# EAGLE design mega_pro-v13 (EAGLE 5.11)
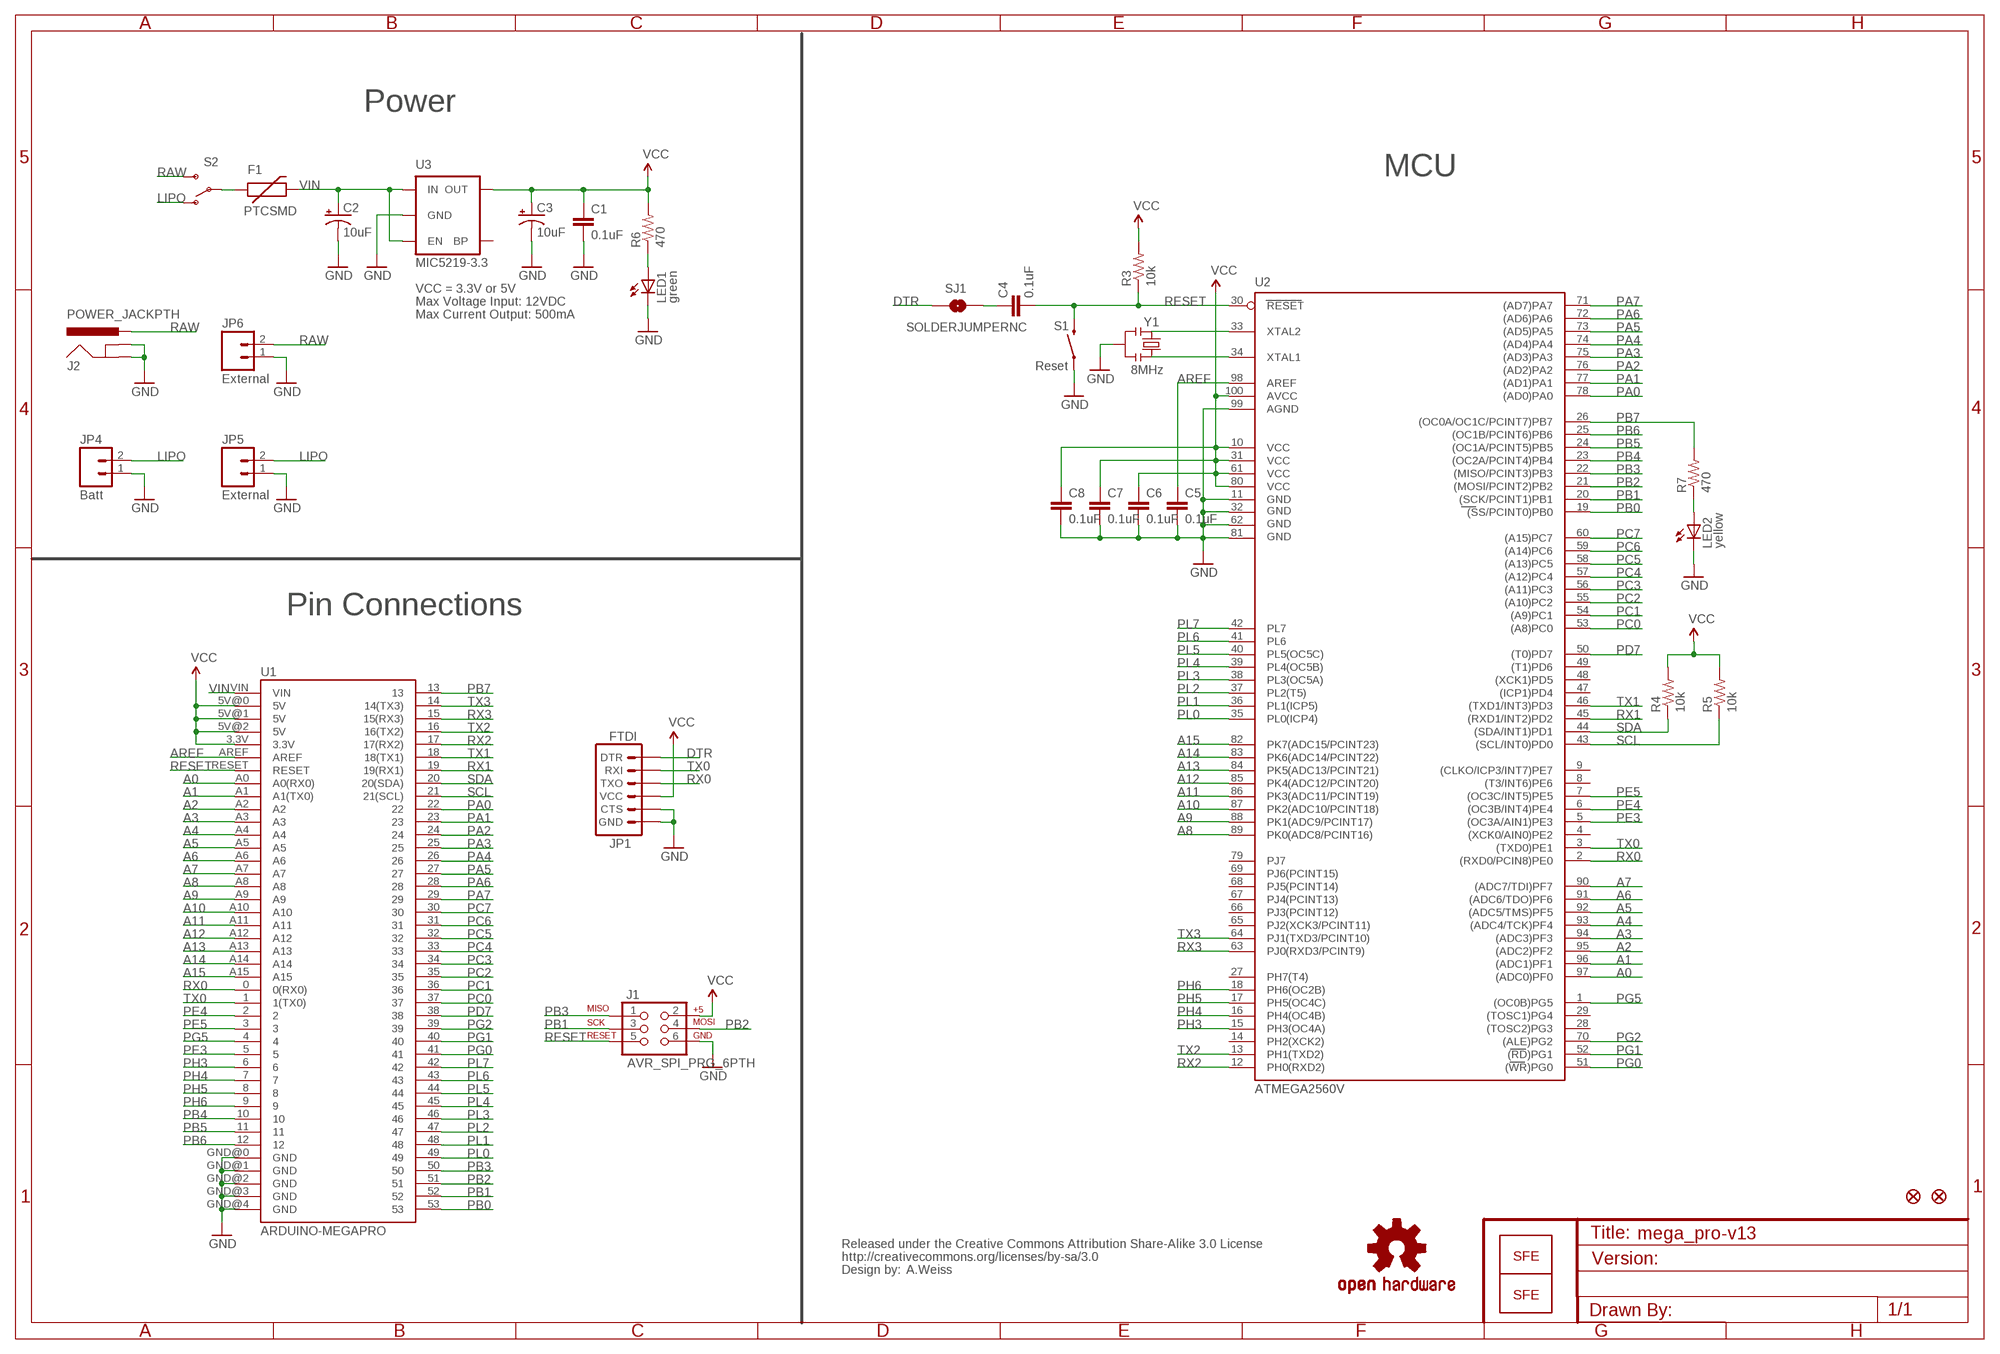
[diagram p0: schematic, sheet 1]

## Parts
C1  0.1uF  CAP0402-CAP  [0402-CAP]
C2  10uF  CAP_POL1206  [EIA3216]
C3  10uF  CAP_POL1206  [EIA3216]
C4  0.1uF  CAP0402-CAP  [0402-CAP]
C5  0.1uF  CAP0402-CAP  [0402-CAP]
C6  0.1uF  CAP0402-CAP  [0402-CAP]
C7  0.1uF  CAP0402-CAP  [0402-CAP]
C8  0.1uF  CAP0402-CAP  [0402-CAP]
F1  PTCSMD  [PTC-1206]
J1  AVR_SPI_PRG_6PTH  [2X3]
J2  POWER_JACKPTH  [POWER_JACK_PTH]
JP1  FTDI  ARDUINO_SERIAL_PROGRAMSMD  [1X06-SMD]
JP2  LOGO-SFENEW  [SFE-NEW-WEBLOGO]
JP3  LOGO-SFENEW  [SFE-NEW-WEBLOGO]
JP4  Batt  M02-JST-2MM-SMT  [JST-2-SMD]
JP5  External  M02PTH  [1X02]
JP6  External  M02PTH  [1X02]
JP7  FIDUCIAL1X2.5  [FIDUCIAL-1X2.5]
JP8  FIDUCIAL1X2.5  [FIDUCIAL-1X2.5]
LED1  green  LED0603  [LED-0603]
LED2  yellow  LED0603  [LED-0603]
R3  10k  RESISTOR0402-RES  [0402-RES]
R4  10k  RESISTOR0402-RES  [0402-RES]
R5  10k  RESISTOR0402-RES  [0402-RES]
R6  470  RESISTOR0402-RES  [0402-RES]
R7  470  RESISTOR0402-RES  [0402-RES]
S1  SWITCH-MOMENTARY-2SMD  [TACTILE_SWITCH_SMD]
S2  SWITCH-SPST-SMD-A  [SWITCH-SPST-SMD-A]
SJ1  SOLDERJUMPERNC  [SJ_2S]
U1  ARDUINO-MEGAPRO  [ARDUINO_MEGA-PRO]
U2  ATMEGA2560AU  [TQFP100]
U3  V_REG_LDOSMD  [SOT23-5]
U$1  OSHW-LOGOM  [OSHW-LOGO-M]
U$2  CREATIVE_COMMONS  [CREATIVE_COMMONS]
Y1  RESONATORSMD  [RESONATOR-SMD]

## Nets
A0: U1.A0(A0(RX0)) U2.97((ADC0)PF0)
A1: U1.A1(A1(TX0)) U2.96((ADC1)PF1)
A2: U1.A2 U2.95((ADC2)PF2)
A3: U1.A3 U2.94((ADC3)PF3)
A4: U1.A4 U2.93((ADC4/TCK)PF4)
A5: U1.A5 U2.92((ADC5/TMS)PF5)
A6: U1.A6 U2.91((ADC6/TDO)PF6)
A7: U1.A7 U2.90((ADC7/TDI)PF7)
A8: U1.A8 U2.89(PK0(ADC8/PCINT16))
A9: U1.A9 U2.88(PK1(ADC9/PCINT17))
A10: U1.A10 U2.87(PK2(ADC10/PCINT18))
A11: U1.A11 U2.86(PK3(ADC11/PCINT19))
A12: U1.A12 U2.85(PK4(ADC12/PCINT20))
A13: U1.A13 U2.84(PK5(ADC13/PCINT21))
A14: U1.A14 U2.83(PK6(ADC14/PCINT22))
A15: U1.A15 U2.82(PK7(ADC15/PCINT23))
AREF: C5.1 U1.AREF U2.98(AREF)
DTR: JP1.1(DTR) SJ1.1
GND: C1.2 C2.C(-) C3.C(-) C5.2 C6.2 C7.2 C8.2 J1.6 J2.GND J2.GNDBREAK JP1.5(CTS) JP1.6(GND) JP4.1 JP5.1 JP6.1 LED1.C LED2.C S1.1 U1.GND@0(GND) U1.GND@1(GND) U1.GND@2(GND) U1.GND@3(GND) U1.GND@4(GND) U2.11(GND) U2.32(GND1) U2.62(GND2) U2.81(GND3) U2.99(AGND) U3.2(GND) Y1.2
LIPO: JP4.2 JP5.2 S2.1(O)
N$1: F1.1 S2.2(P)
N$2: LED1.A R6.1
N$3: LED2.A R7.1
N$4: C4.1 SJ1.2
N$73: U2.33(XTAL2) Y1.1
N$74: U2.34(XTAL1) Y1.3
PA0: U1.22 U2.78((AD0)PA0)
PA1: U1.23 U2.77((AD1)PA1)
PA2: U1.24 U2.76((AD2)PA2)
PA3: U1.25 U2.75((AD3)PA3)
PA4: U1.26 U2.74((AD4)PA4)
PA5: U1.27 U2.73((AD5)PA5)
PA6: U1.28 U2.72((AD6)PA6)
PA7: U1.29 U2.71((AD7)PA7)
PB0: U1.53 U2.19((SS/PCINT0)PB0)
PB1: J1.3 U1.52 U2.20((SCK/PCINT1)PB1)
PB2: J1.4 U1.51 U2.21((MOSI/PCINT2)PB2)
PB3: J1.1 U1.50 U2.22((MISO/PCINT3)PB3)
PB4: U1.10 U2.23((OC2A/PCINT4)PB4)
PB5: U1.11 U2.24((OC1A/PCINT5)PB5)
PB6: U1.12 U2.25((OC1B/PCINT6)PB6)
PB7: R7.2 U1.13 U2.26((OC0A/OC1C/PCINT7)PB7)
PC0: U1.37 U2.53((A8)PC0)
PC1: U1.36 U2.54((A9)PC1)
PC2: U1.35 U2.55((A10)PC2)
PC3: U1.34 U2.56((A11)PC3)
PC4: U1.33 U2.57((A12)PC4)
PC5: U1.32 U2.58((A13)PC5)
PC6: U1.31 U2.59((A14)PC6)
PC7: U1.30 U2.60((A15)PC7)
PD7: U1.38 U2.50((T0)PD7)
PE3: U1.5 U2.5((OC3A/AIN1)PE3)
PE4: U1.2 U2.6((OC3B/INT4)PE4)
PE5: U1.3 U2.7((OC3C/INT5)PE5)
PG0: U1.41 U2.51((WR)PG0)
PG1: U1.40 U2.52((RD)PG1)
PG2: U1.39 U2.70((ALE)PG2)
PG5: U1.4 U2.1((OC0B)PG5)
PH3: U1.6 U2.15(PH3(OC4A))
PH4: U1.7 U2.16(PH4(OC4B))
PH5: U1.8 U2.17(PH5(OC4C))
PH6: U1.9 U2.18(PH6(OC2B))
PL0: U1.49 U2.35(PL0(ICP4))
PL1: U1.48 U2.36(PL1(ICP5))
PL2: U1.47 U2.37(PL2(T5))
PL3: U1.46 U2.38(PL3(OC5A))
PL4: U1.45 U2.39(PL4(OC5B))
PL5: U1.44 U2.40(PL5(OC5C))
PL6: U1.43 U2.41(PL6)
PL7: U1.42 U2.42(PL7)
RAW: J2.PWR JP6.2 S2.3(S)
RESET: C4.2 J1.5 R3.1 S1.3 U1.RESET U2.30(RESET)
RX0: JP1.3(TXO) U1.0(0(RX0)) U2.2((RXD0/PCIN8)PE0)
RX1: U1.19(19(RX1)) U2.45((RXD1/INT2)PD2)
RX2: U1.17(17(RX2)) U2.12(PH0(RXD2))
RX3: U1.15(15(RX3)) U2.63(PJ0(RXD3/PCINT9))
SCL: R5.1 U1.21(21(SCL)) U2.43((SCL/INT0)PD0)
SDA: R4.1 U1.20(20(SDA)) U2.44((SDA/INT1)PD1)
TX0: JP1.2(RXI) U1.1(1(TX0)) U2.3((TXD0)PE1)
TX1: U1.18(18(TX1)) U2.46((TXD1/INT3)PD3)
TX2: U1.16(16(TX2)) U2.13(PH1(TXD2))
TX3: U1.14(14(TX3)) U2.64(PJ1(TXD3/PCINT10))
VCC: C1.1 C3.A(+) C6.1 C7.1 C8.1 J1.2 JP1.4(VCC) R3.2 R4.2 R5.2 R6.2 U1.3.3V U1.5V@0(5V) U1.5V@1(5V) U1.5V@2(5V) U2.10(VCC) U2.31(VCC1) U2.61(VCC2) U2.80(VCC3) U2.100(AVCC) U3.5(OUT)
VIN: C2.A(+) F1.2 U1.VIN U3.1(IN) U3.3(EN)
Unconnected: U2.4((XCK0/AIN0)PE2) U2.8((T3/INT6)PE6) U2.9((CLKO/ICP3/INT7)PE7) U2.14(PH2(XCK2)) U2.27(PH7(T4)) U2.28((TOSC2)PG3) U2.29((TOSC1)PG4) U2.47((ICP1)PD4) U2.48((XCK1)PD5) U2.49((T1)PD6) U2.65(PJ2(XCK3/PCINT11)) U2.66(PJ3(PCINT12)) U2.67(PJ4(PCINT13)) U2.68(PJ5(PCINT14)) U2.69(PJ6(PCINT15)) U2.79(PJ7) U3.4(BP)

## Notes on the sheet
- Power
- MCU
- MIC5219-3.3
- VCC = 3.3V or 5V
- Max Voltage Input: 12VDC
- Max Current Output: 500mA
- Reset
- 8MHz
- Pin Connections
- ATMEGA2560V
- A.Weiss

## Library data of the parts
C1 C4-C8 = SparkFun:CAP: Capacitor Standard 0603 ceramic capacitor, and 0.1" leaded capacitor.
C2 C3 = SparkFun:CAP_POL: Capacitor Polarized These are standard SMD and PTH capacitors. Normally 10uF, 47uF, and 100uF in electrolytic and tantalum varieties. Always verify the external diameter of the through hole cap, it varies with capacity, voltage, and manufacturer. The EIA devices should be standard.
F1 = SparkFun:PTC: Resettable Fuse PTC Resettable Fuse. Spark Fun Electronics SKU : COM-08357
J1 = SparkFun:AVR_SPI_PRG_6: AVR ISP 6 Pin This is the reduced ISP connector for AVR programming. Common on Arduino. This footprint will take up less PCB space and can be used with a 10-pin to 6-pin adapter such as SKU: BOB-08508
J2 = SparkFun:POWER_JACK: Power Jack This is the standard 5.5mm barrel jack for power. The PTH is the most common, proven, reliable, footprint. All others are experimental. The Slot footprint only works if the mill layer is transmitted to the PCB fab house so be warned. Spark Fun Electronics SKU : PRT-00119. Mating wall wart : TOL-00298 (and others)
JP1 = SparkFun:ARDUINO_SERIAL_PROGRAM
JP2 JP3 = SparkFun:LOGO-SFE: Spark Fun Electronics PCB Logo This is the standard Spark Fun Electronics PCB logo.
JP4-JP6 = SparkFun:M02: Header 2 Standard 2-pin 0.1" header. Use with straight break away headers (SKU : PRT-00116), right angle break away headers (PRT-00553), swiss pins (PRT-00743), machine pins (PRT-00117), and female headers (PRT-00115). Molex polarized connector foot print use with SKU : PRT-08233 with associated crimp pins and housings.
JP7 JP8 = abes:FIDUCIAL: Fiducial Alignment Points Various fiducial points for machine vision alignment.
LED1 LED2 = SparkFun:LED: LEDs Standard schematic elements and footprints for 5mm, 3mm, 1206, and 0603 sized LEDs. 5mm - Spark Fun Electronics SKU : COM-00529 (and others)
R3-R7 = SparkFun:RESISTOR: Resistor Basic schematic elements and footprints for 0603, 1206, and PTH resistors.
S1 = SparkFun:SWITCH-MOMENTARY-2
S2 = SparkFun:SWITCH-SPST: SPST Switch Simple slide switch. Spark Fun Electronics SKU : COM-00102
SJ1 = SparkFun:SOLDERJUMPER: Solder Jumper Standard SMD solder jumper. Used to automate production. Two varients : Normally Open and Normally Closed are the same, but have different paste layers. NC will have a large amount of paste and should jumper during reflow.
U1 = SparkFun:ARDUINO-MEGA: Arduino Mega footprint connections
U2 = SparkFun:ATMEGA2560: MICROCONTROLLER 64/128/256 Kbytes FLASH 4 Kbytes EEPROM 8 Kbytes SRAM 86 General Purpose I/O pins 12-channels16-bit PWM 4 x Serial USARTs 16-channels 10-bit A/D
U3 = SparkFun:V_REG_LDO: Voltage Regulator LDO Standard 150mA LDO voltage regulator in SOT-23 layout. Micrel part MIC5205. BP (by-pass) pin is used to lower output noise with 470pF cap.
U$1 = SparkFun:OSHW-LOGO: Open Source Hardware Logo This logo indicates the piece of hardware it is found on incorporates a OSHW license and/or adheres to the definition of open source hardware found here: http://freedomdefined.org/OSHW
U$2 = SparkFun:CREATIVE_COMMONS
Y1 = SparkFun:RESONATOR: Resonator Small SMD resonator. This is the itty bitty 10/20MHz resonators with built in caps. CSTCE10M0G55 and CSTCE20M0V53. Footprint has been reviewed closely but hasn't been tested yet.

## Board
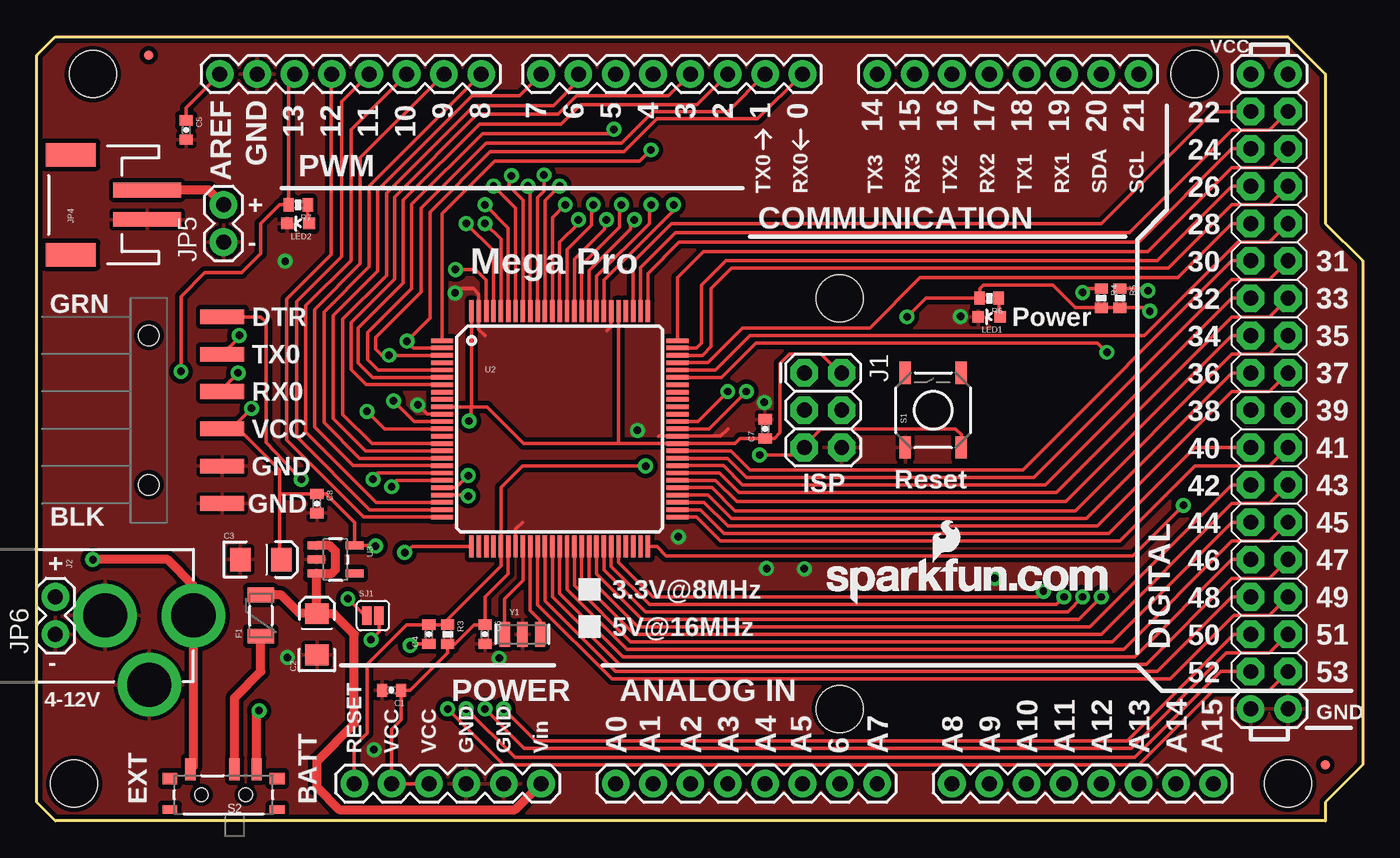
[diagram p1: board, top side]
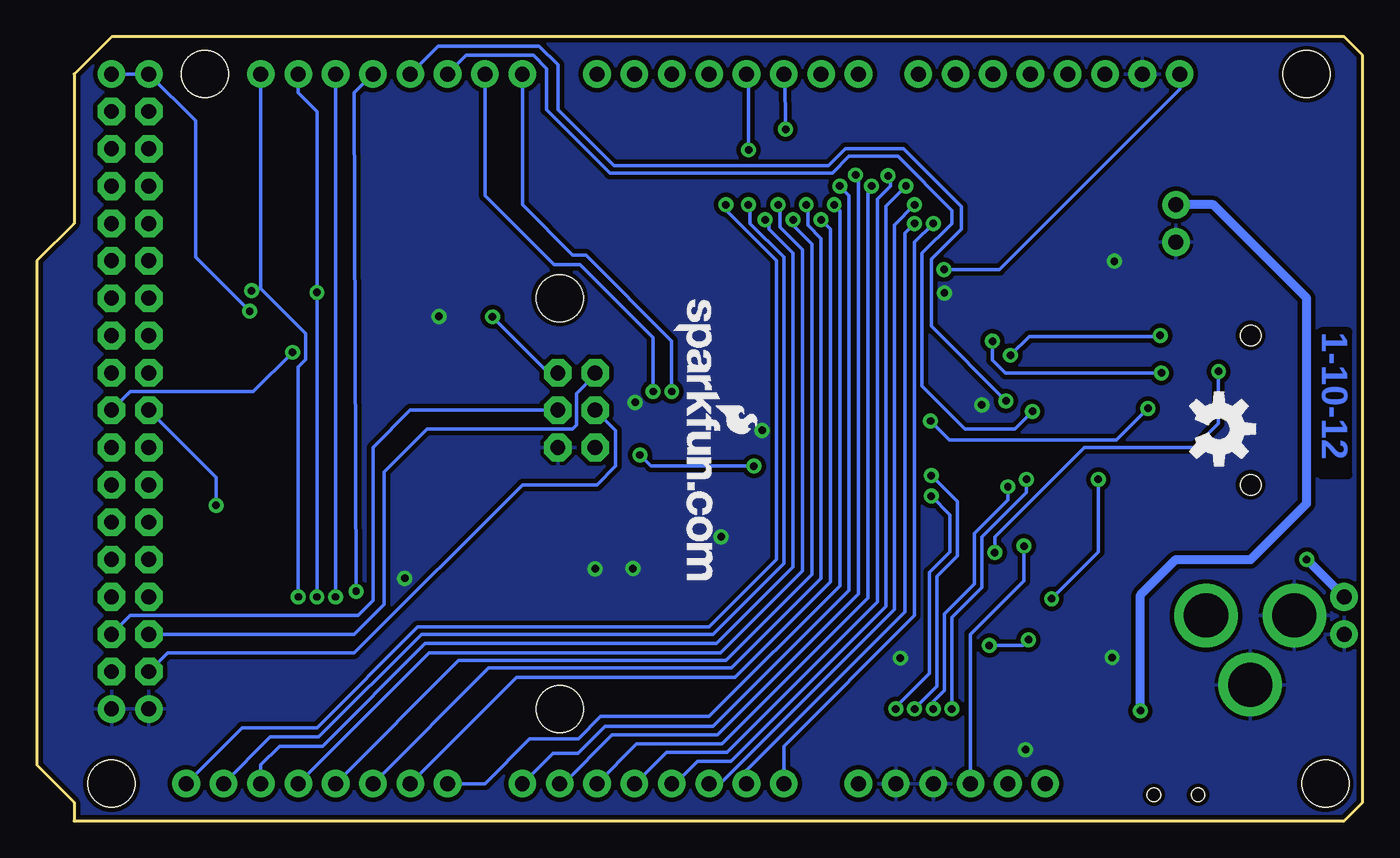
[diagram p2: board, bottom side, seen from below]

Size 90.17 x 53.34 mm. Coordinates in mm from the lower left corner, seen from the top.
Copper layers (1*16): Top 0.035mm / dielectric 1.5mm / Bottom 0.035mm
Design rules "SparkFun": minimum track width 8mil, minimum drill 20mil, track to track 8mil, track to pad 8mil, pad to pad 8mil, via to via 8mil, smd to smd 8mil, copper to edge 8mil, drill to drill 8mil, minimum pad ring 12mil, minimum via ring 10mil, stop-mask expansion 4mil, vias tented up to drill 20mil, thermal gap 10mil

### Footprints (pad centres in the part's own frame; a part is rotated, then mirrored left to right if it is on the bottom)
0402-CAP = smd 0.7 x 0.9: 1 -0.65,0; 2 0.65,0
EIA3216 = smd 1.4 x 1.6: A 1.4,0; C -1.4,0
PTC-1206 = smd 1 x 1.8: 1 -1.4,0; 2 1.4,0
2X3 = drill 1.016 pad 1.88 octagon: 1 0,0; 2 0,2.54; 3 2.54,0; 4 2.54,2.54; 5 5.08,0; 6 5.08,2.54
POWER_JACK_PTH = drill 2.997 pad 4.318 round: GND 0,7.7; GNDBREAK 4.7,10.7; PWR 0,13.7
1X06-SMD = smd 1 x 3: 1 -6.35,5; 2 -3.81,5; 3 -1.27,5; 4 1.27,5; 5 3.81,5; 6 6.35,5 | hole 1.4: -5.08,0; 5.08,0
JST-2-SMD = smd 1 x 4.6: 1 -1,-3.7; 2 1,-3.7 | smd 1.6 x 3.4: NC1 -3.4,1.5; NC2 3.4,1.5
1X02 = drill 1.016 pad 1.88 round: 1 0,0; 2 2.54,0
FIDUCIAL-1X2.5 = smd 0.635 x 0.635: 1 0,0
LED-0603 = smd 0.8 x 0.8: A 0,-0.75; C 0,0.75
0402-RES = smd 0.7 x 0.9: 1 -0.65,0; 2 0.65,0
TACTILE_SWITCH_SMD = smd 1.524 x 0.762: 1 -2.54,1.905; 2 2.54,1.905; 3 -2.54,-1.905; 4 2.54,-1.905
SWITCH-SPST-SMD-A = smd 0.7 x 1.5: 1 -2.25,-1.75; 2 -0.75,-1.75; 3 2.25,-1.75 | smd 1 x 0.6: GND1 -3.65,1; GND3 3.65,1 | smd 1 x 0.8: GND2 -3.65,-1.1; GND4 3.65,-1.1 | hole 0.9: -1.5,0; 1.5,0
SJ_2S = smd 0.635 x 1.27: 1 -0.412,0; 2 0.412,0
ARDUINO_MEGA-PRO = drill 1.016 pad 1.88 round: 0 52.07,50.8; 1 49.53,50.8; 2 46.99,50.8; 3 44.45,50.8; 3.3V 24.13,2.54; 4 41.91,50.8; 5 39.37,50.8; 5V@0 26.67,2.54; 5V@1 82.55,50.8; 5V@2 85.09,50.8; 6 36.83,50.8; 7 34.29,50.8; 8 30.226,50.8; 9 27.686,50.8; 10 25.146,50.8; 11 22.606,50.8; 12 20.066,50.8; 13 17.526,50.8; 14 57.15,50.8; 15 59.69,50.8; 16 62.23,50.8; 17 64.77,50.8; 18 67.31,50.8; 19 69.85,50.8; 20 72.39,50.8; 21 74.93,50.8; A0 39.37,2.54; A1 41.91,2.54; A2 44.45,2.54; A3 46.99,2.54; A4 49.53,2.54; A5 52.07,2.54; A6 54.61,2.54; A7 57.15,2.54; A8 62.23,2.54; A9 64.77,2.54; A10 67.31,2.54; A11 69.85,2.54; A12 72.39,2.54; A13 74.93,2.54; A14 77.47,2.54; A15 80.01,2.54; AREF 12.446,50.8; GND@0 29.21,2.54; GND@1 31.75,2.54; GND@2 82.55,7.62; GND@3 85.09,7.62; GND@4 14.986,50.8; RESET 21.59,2.54; VIN 34.29,2.54 | drill 1.016 pad 1.88 octagon: 22 82.55,48.26; 23 85.09,48.26; 24 82.55,45.72; 25 85.09,45.72; 26 82.55,43.18; 27 85.09,43.18; 28 82.55,40.64; 29 85.09,40.64; 30 82.55,38.1; 31 85.09,38.1; 32 82.55,35.56; 33 85.09,35.56; 34 82.55,33.02; 35 85.09,33.02; 36 82.55,30.48; 37 85.09,30.48; 38 82.55,27.94; 39 85.09,27.94; 40 82.55,25.4; 41 85.09,25.4; 42 82.55,22.86; 43 85.09,22.86; 44 82.55,20.32; 45 85.09,20.32; 46 82.55,17.78; 47 85.09,17.78; 48 82.55,15.24; 49 85.09,15.24; 50 82.55,12.7; 51 85.09,12.7; 52 82.55,10.16; 53 85.09,10.16 | hole 3.2: 3.81,50.8; 2.54,2.54; 54.61,35.56; 54.61,7.62; 78.74,50.8; 85.09,2.54
TQFP100 = smd 1.5 x 0.3: 1 -8,6; 2 -8,5.5; 3 -8,5; 4 -8,4.5; 5 -8,4; 6 -8,3.5; 7 -8,3; 8 -8,2.5; 9 -8,2; 10 -8,1.5; 11 -8,1; 12 -8,0.5; 13 -8,0; 14 -8,-0.5; 15 -8,-1; 16 -8,-1.5; 17 -8,-2; 18 -8,-2.5; 19 -8,-3; 20 -8,-3.5; 21 -8,-4; 22 -8,-4.5; 23 -8,-5; 24 -8,-5.5; 25 -8,-6; 51 8,-6; 52 8,-5.5; 53 8,-5; 54 8,-4.5; 55 8,-4; 56 8,-3.5; 57 8,-3; 58 8,-2.5; 59 8,-2; 60 8,-1.5; 61 8,-1; 62 8,-0.5; 63 8,0; 64 8,0.5; 65 8,1; 66 8,1.5; 67 8,2; 68 8,2.5; 69 8,3; 70 8,3.5; 71 8,4; 72 8,4.5; 73 8,5; 74 8,5.5; 75 8,6 | smd 0.3 x 1.5: 26 -6,-8; 27 -5.5,-8; 28 -5,-8; 29 -4.5,-8; 30 -4,-8; 31 -3.5,-8; 32 -3,-8; 33 -2.5,-8; 34 -2,-8; 35 -1.5,-8; 36 -1,-8; 37 -0.5,-8; 38 0,-8; 39 0.5,-8; 40 1,-8; 41 1.5,-8; 42 2,-8; 43 2.5,-8; 44 3,-8; 45 3.5,-8; 46 4,-8; 47 4.5,-8; 48 5,-8; 49 5.5,-8; 50 6,-8; 76 6,8; 77 5.5,8; 78 5,8; 79 4.5,8; 80 4,8; 81 3.5,8; 82 3,8; 83 2.5,8; 84 2,8; 85 1.5,8; 86 1,8; 87 0.5,8; 88 0,8; 89 -0.5,8; 90 -1,8; 91 -1.5,8; 92 -2,8; 93 -2.5,8; 94 -3,8; 95 -3.5,8; 96 -4,8; 97 -4.5,8; 98 -5,8; 99 -5.5,8; 100 -6,8
SOT23-5 = smd 0.55 x 1.2: 1 -0.95,-1.3; 2 0,-1.3; 3 0.95,-1.3; 4 0.95,1.3; 5 -0.95,1.3
RESONATOR-SMD = smd 0.7 x 1.7: 1 -1.2,0; 2 0,0; 3 1.2,0

### Placement (x,y rotation side)
C1  24.13,8.89 180 top
C2  19.05,12.7 90 top
C3  15.24,17.78 0 top
C4  26.67,12.7 90 top
C5  10.16,46.99 270 top
C6  30.48,12.7 270 top
C7  49.53,26.67 90 top
C8  19.05,21.59 270 top
F1  15.24,13.97 90 top
J1  52.2,30.48 270 top
J2  -3.05,13.97 270 top
JP1  7.62,27.94 270 top
JP2  53.72,14.73 0 top
JP3  46.86,35.43 270 bottom
JP4  3.81,41.91 90 top
JP5  12.7,39.37 90 top
JP6  1.27,12.7 90 top
JP7  7.62,52.07 0 top
JP8  87.63,3.81 0 top
LED1  64.77,34.29 90 top
LED2  17.78,40.64 90 top
R3  27.94,12.7 270 top
R4  72.39,35.56 270 top
R5  73.66,35.56 270 top
R6  64.77,35.56 180 top
R7  17.78,41.91 180 top
S1  60.96,27.94 90 top
S2  12.7,1.78 180 top
SJ1  22.86,13.97 0 top
U1  0,0 0 top
U2  35.56,26.67 0 top
U3  20.32,17.78 270 top
U$1  9.78,26.67 270 bottom
U$2  16.51,-10.16 0 top  (outside the outline)
Y1  33.02,12.7 0 top

### Tracks (layer width: path | path; a pad name or v marks a point on that pad's centre or on a via)
A0  (via drill 0.51)
  Top 0.254: U2.97 31.06,38.79 v29.21,40.64
  Bottom 0.254: U1.A0 39.37,5.08 30.48,13.97 30.48,39.37 v29.21,40.64
A1  (via drill 0.51)
  Top 0.254: U2.96 31.56,39.56 v30.48,40.64
  Bottom 0.254: U1.A1 41.91,3.45 31.14,14.22 31.14,39.98 v30.48,40.64
A2  (via drill 0.51)
  Top 0.254: U2.95 32.06,40.33 v30.48,41.91
  Bottom 0.254: U1.A2 43.71,2.54 31.85,14.4 31.85,40.54 v30.48,41.91
A3  (via drill 0.51)
  Top 0.254: U2.94 32.56,41.68 v31.06,43.18
  Bottom 0.254: U1.A3 46.76,2.54 45.24,4.06 42.98,4.06 32.44,14.61 32.44,41.81 v31.06,43.18
A4  (via drill 0.51)
  Top 0.254: U2.93 33.06,42.23 32.11,43.18 32.11,43.71 v32.28,43.89
  Bottom 0.254: U1.A4 49.48,2.54 47.35,4.67 43.23,4.67 32.99,14.91 32.99,42.29 32.11,43.18 32.11,43.71 v32.28,43.89
A5  (via drill 0.51)
  Top 0.254: U2.92 33.56,43.02 v33.4,43.18
  Bottom 0.254: U1.A5 49.38,5.23 43.59,5.23 33.66,15.16 33.66,42.93 v33.4,43.18
A6  (via drill 0.51)
  Top 0.254: U2.91 34.06,42.39 34.49,42.82 v34.49,43.94
  Bottom 0.254: U1.A6 54.36,2.54 51.05,5.84 43.89,5.84 34.29,15.44 34.29,43.74 v34.49,43.94
A7  (via drill 0.51)
  Top 0.254: U2.90 34.56,42.18 v35.56,43.18
  Bottom 0.254: U1.A7 57.12,2.54 55.07,4.6 53.37,4.6 51.51,6.45 44.17,6.45 34.92,15.7 34.92,42.55 v35.56,43.18
A8  (via drill 0.51)
  Top 0.254: U2.89 35.06,41.03 v35.94,41.91
  Bottom 0.254: U1.A8 59.69,2.54 56.64,5.59 53.34,5.59 51.82,7.11 44.45,7.11 35.56,16 35.56,41.53 v35.94,41.91
A9  (via drill 0.51)
  Top 0.254: U2.88 35.56,39.37 36.83,40.64 v36.83,40.89
  Bottom 0.254: U1.A9 57.53,9.78 42.67,9.78 36.2,16.26 36.2,40.26 v36.83,40.89
A10  (via drill 0.51)
  Top 0.254: U2.87 36.06,38.85 37.72,40.51 37.72,41.78 v37.85,41.91
  Bottom 0.254: U1.A10 59.44,10.41 42.93,10.41 36.83,16.51 36.83,39.62 37.72,40.51 37.72,41.78 v37.85,41.91
A11  (via drill 0.51)
  Top 0.254: U2.86 36.56,38.21 38.61,40.26 38.61,40.77 v38.73,40.89
  Bottom 0.254: U1.A11 61.47,10.92 43.31,10.92 37.47,16.76 37.47,39.24 38.61,40.39 38.61,40.77 v38.73,40.89
A12  (via drill 0.51)
  Top 0.254: U2.85 37.06,37.82 39.62,40.39 39.62,41.78 v39.75,41.91
  Bottom 0.254: U1.A12 63.5,11.43 43.69,11.43 38.1,17.02 38.1,38.86 39.62,40.39 39.62,41.78 v39.75,41.91
A13  (via drill 0.51)
  Top 0.254: U2.84 37.56,37.43 40.39,40.26 40.39,40.64 v40.64,40.89
  Bottom 0.254: U1.A13 74.93,3.81 73.66,5.08 70.74,5.08 63.75,12.06 43.94,12.06 38.73,17.27 38.73,38.61 40.39,40.26 40.39,40.64 v40.64,40.89
A14  (via drill 0.51)
  Top 0.254: U2.83 38.06,37.04 41.66,40.64 41.66,41.78 v41.78,41.91
  Bottom 0.254: U1.A14 74.3,5.71 70.99,5.71 64.01,12.7 44.2,12.7 39.37,17.53 39.37,38.35 41.66,40.64 41.66,41.78 v41.78,41.91
A15  (via drill 0.51)
  Top 0.254: U2.82 38.56,36.78 43.31,41.53 v43.31,41.91
  Bottom 0.254: U1.A15 76.2,6.35 71.12,6.35 64.26,13.21 44.45,13.21 39.88,17.78 39.88,38.1 43.18,41.4 43.18,41.78 v43.31,41.91
AREF  (via drill 0.51)
  Top 0.254: 28.75,37.52 v28.47,37.52 29.84,37.52 30.56,36.8 U2.98 | C5.1 10.16,48.51 U1.AREF
  Bottom 0.254: U1.AREF 12.45,49.78 24.71,37.52 v28.47,37.52
DTR  (via drill 0.51)
  Top 0.254: 13.97,34.29 JP1.1 15.24,34.29 15.6,33.93 15.6,25.76 v17.98,23.24 | SJ1.1 22.3,13.97 v21.16,15.11
  Bottom 0.254: v17.98,23.24 17.98,18.29 v21.16,15.11
GND  (via drill 0.51)
  Top 0.254: U2.32 32.56,19.86 33.02,20.32 | 42.29,26.16 42.3,26.17 U2.62 46.49,26.17 46.99,26.67 | 30.48,33.02 30.06,33.44 U2.99 30.06,35.83 29.69,36.2 28.88,36.2 28.68,35.99 28.65,35.99 28.57,35.92 | U2.81 39.06,33.62 38.79,33.35 | U2.11 26.53,27.67 v25.91,28.3
  other vias: 17.04,11.13 22.94,4.85 28.45,35.92 31.45,11.07 43.64,19.33 62.81,34.32 49.48,28.47 52.2,17.14 49.63,17.17 65.15,16.51 16.89,38.07 40.84,26.57
  pour Bottom (isolate 0.305): 0,53.34 88.9,53.34 90.17,52.07 90.17,1.27 88.9,0 1.27,0 0,1.27
  pour Top (isolate 0.305): 0,53.34 88.9,53.34 90.17,52.07 90.17,1.27 88.9,0 1.27,0 0,1.27
LIPO  (via drill 0.51)
  Top 0.61: 15.2,7.41 v15.11,7.49 14.95,7.33 S2.1 | JP4.2 11.7,42.91 JP5.2
  Bottom 0.61: JP5.2 10.16,41.91 3.81,35.56 3.81,21.59 7.62,17.78 12.7,17.78 15.11,15.37 v15.11,7.49
N$1
  Top 0.61: S2.2 13.45,8.37 15.24,10.16 F1.1
N$2
  Top 0.254: R6.1 65.42,34.39 LED1.A
N$3
  Top 0.254: R7.1 18.43,40.74 LED2.A
N$4  (via drill 0.51)
  Top 0.254: SJ1.2 23.27,12.86 v22.73,12.32 | C4.1 25.51,12.05 v25.4,11.94
  Bottom 0.254: v25.4,11.94 23.11,11.94 v22.73,12.32
N$73
  Top 0.203: Y1.1 31.8,12.72
  Top 0.254: U2.33 33.06,16.35 31.8,15.09 31.8,12.72
N$74
  Top 0.254: U2.34 33.56,14.32 34.22,13.66 Y1.3
PA0
  Top 0.254: U2.78 40.56,38.02 43.18,40.64 72.39,40.64 80.01,48.26 U1.22
PA1
  Top 0.254: U2.77 41.06,37.63 43.43,40.01 74.3,40.01 81.28,46.99 83.82,46.99 U1.23
PA2
  Top 0.254: U2.76 41.56,37.24 43.69,39.37 74.93,39.37 81.28,45.72 U1.24
PA3
  Top 0.254: U2.75 43.56,36.96 45.34,38.73 75.56,38.73 81.28,44.45 83.82,44.45 U1.25
PA4
  Top 0.254: U2.74 44.87,32.17 45.21,32.51 45.21,36.45 46.86,38.1 76.2,38.1 81.28,43.18 U1.26
PA5
  Top 0.254: U2.73 45.26,31.67 45.85,32.26 45.85,36.2 47.24,37.59 76.96,37.59 81.28,41.91 83.82,41.91 U1.27
PA6
  Top 0.254: U2.72 45.65,31.17 48.01,33.53 56.64,33.53 60.07,36.96 77.6,36.96 81.28,40.64 U1.28
PA7
  Top 0.254: U2.71 46.16,30.67 48.51,33.02 75.31,33.02 81.66,39.37 83.82,39.37 U1.29
PB0  (via drill 0.51)
  Top 0.254: U2.19 23.16,23.67 v22.86,23.24 | U1.53 83.82,8.89 80.01,8.89 74.93,3.81 31.75,3.81 v27.94,7.62
  Bottom 0.254: v27.94,7.62 27.94,13.84 25.91,15.88 25.91,19.3 22.86,22.35 v22.86,23.24
PB1  (via drill 0.51)
  Top 0.254: U2.20 24.44,23.17 v24.13,22.73 | U1.52 80.52,10.16 74.68,4.32 32.51,4.32 v29.21,7.62
  Bottom 0.254: v29.21,7.62 29.21,8.13 28.45,8.89 28.45,14.1 26.42,16.13 26.42,19.56 24.13,21.84 v24.13,22.73 | J1.3 50.8,26.54 50.8,24.13 52.07,22.86 57.15,22.86 68.58,11.43 81.28,11.43 U1.52
PB2  (via drill 0.51)
  Top 0.254: U2.21 28.51,22.67 v29.34,23.5 | U1.51 83.82,11.43 80.9,11.43 74.42,4.95 33.15,4.95 v30.48,7.62
  Bottom 0.254: v30.48,7.62 28.96,9.14 28.96,16.64 27.56,18.03 27.56,21.72 v29.34,23.5 | J1.4 64.77,27.94 67.31,25.4 67.31,14.99 68.33,13.97 83.82,13.97 U1.51
PB3  (via drill 0.51)
  Top 0.254: U2.22 29.27,22.17 v29.34,22.1 | U1.50 81.41,12.7 74.17,5.46 33.91,5.46 v31.75,7.62
  Bottom 0.254: v29.34,22.1 28.07,20.83 28.07,18.29 29.46,16.89 29.46,10.03 31.75,7.75 v31.75,7.62 | J1.1 52.2,30.35 53.47,29.08 53.47,26.92 53.72,26.67 63.63,26.67 66.55,23.75 66.55,14.73 68.58,12.7 U1.50
PB4
  Top 0.254: U2.23 23.09,21.67 18.29,26.47 18.29,35.05 21.36,38.12 21.36,47.02 U1.10 25.12,50.77
PB5
  Top 0.254: U2.24 22.64,21.17 17.68,26.14 17.68,35.33 20.73,38.38 20.73,48.92 U1.11 22.55,50.75
PB6
  Top 0.254: U2.25 22.23,20.67 16.99,25.91 16.99,35.51 20.02,38.53 20.02,50.75 U1.12
PB7  (via drill 0.51)
  Top 0.254: U1.13 17.13,50.4 R7.2 16.51,41.91 15.24,40.64 15.24,38.58 13.95,37.29 11.43,37.29 9.8,35.66 v9.8,30.58 | U2.26 25.55,18.67 v25.02,18.26
  Bottom 0.254: v25.02,18.26 25.02,19.3 18.92,25.4 11.43,25.4 9.8,27.03 v9.8,30.58
PC0
  Top 0.254: U2.53 45.39,21.67 46.99,20.07 72.14,20.07 81.28,29.21 83.82,29.21 U1.37
PC1
  Top 0.254: U2.54 45.65,22.17 47.24,20.57 71.37,20.57 81.28,30.48 U1.36
PC2
  Top 0.254: U2.55 45.91,22.67 47.5,21.08 70.61,21.08 81.28,31.75 83.82,31.75 U1.35
PC3
  Top 0.254: U2.56 46.17,23.17 47.62,21.72 69.98,21.72 81.28,33.02 U1.34
PC4
  Top 0.254: U2.57 46.43,23.67 47.75,22.35 69.34,22.35 81.28,34.29 83.82,34.29 U1.33
PC5
  Top 0.254: U2.58 46.7,24.17 48.01,22.86 68.58,22.86 81.28,35.56 U1.32
PC6
  Top 0.254: U2.59 46.96,24.67 48.26,23.37 67.82,23.37 81.28,36.83 83.82,36.83 U1.31
PC7
  Top 0.254: U2.60 47.22,25.17 48.51,23.88 67.06,23.88 81.28,38.1 U1.30
PD7  (via drill 0.51)
  Top 0.254: U2.50 42.16,18.67 42.8,18.03 74.55,18.03 v77.98,21.46
  Bottom 0.254: v77.98,21.46 77.98,23.37 U1.38
PE3  (via drill 0.51)
  Top 0.254: U2.5 23.23,30.67 22.5,31.39 22.5,33.22 25.5,36.22 25.5,41.96 30.3,46.76 38.99,46.76 39.24,47.02 v39.24,47.04
  Bottom 0.254: v39.24,47.04 39.29,50.72 U1.5
PE4
  Top 0.254: U2.6 22.84,30.17 21.87,31.14 21.87,33.53 24.92,36.58 24.92,42.22 30.1,47.4 35.66,47.4 36.98,48.72 44.91,48.72 U1.2
PE5
  Top 0.254: U2.7 22.4,29.67 21.36,30.71 21.36,33.88 24.33,36.85 24.33,42.44 29.95,48.06 35.43,48.06 36.7,49.33 42.98,49.33 U1.3
PG0
  Top 0.254: U2.51 44.86,20.67 46.48,19.05 73.66,19.05 78.74,24.13 83.82,24.13 U1.41
PG1
  Top 0.254: U2.52 45.12,21.17 46.74,19.56 72.9,19.56 78.74,25.4 U1.40
PG2  (via drill 0.51)
  Top 0.254: U2.70 46.55,30.17 48.9,32.51 72.14,32.51 v72.77,31.88
  Bottom 0.254: U1.39 83.82,29.21 75.44,29.21 v72.77,31.88
PG5  (via drill 0.51)
  Top 0.254: U2.1 27.56,41.3 31.14,44.88 41,44.88 v41.76,45.64
  Bottom 0.254: U1.4 41.76,50.65 v41.76,45.64
PH3
  Top 0.254: U2.15 22.79,25.67 20.8,27.66 20.8,34.14 23.77,37.11 23.77,42.7 29.74,48.67 35.13,48.67 36.75,50.29 | 36.75,50.29 36.83,50.22 | 36.75,50.29 36.75,50.72 U1.6
PH4
  Top 0.254: U2.16 22.38,25.17 20.17,27.38 20.17,34.37 23.19,37.39 23.19,42.9 29.62,49.33 32.82,49.33 U1.7
PH5
  Top 0.254: U2.17 21.96,24.67 19.53,27.1 19.53,34.62 22.61,37.69 22.61,43.18 U1.8 30.25,50.77
PH6
  Top 0.254: U2.18 21.52,24.17 18.9,26.8 18.9,34.8 22,37.9 22,45.11 U1.9 27.76,50.72
PL0
  Top 0.254: U2.35 34.06,14.71 39.12,9.65 77.09,9.65 81.41,13.97 83.82,13.97 U1.49
PL1
  Top 0.254: U2.36 34.56,14.97 39.37,10.16 76.2,10.16 81.28,15.24 U1.48
PL2
  Top 0.254: U2.37 35.06,15.23 39.62,10.67 75.44,10.67 81.28,16.51 83.82,16.51 U1.47
PL3
  Top 0.254: U2.38 35.56,15.49 39.88,11.18 74.68,11.18 81.28,17.78 U1.46
PL4
  Top 0.254: U2.39 36.06,15.76 40.13,11.68 73.91,11.68 81.28,19.05 83.82,19.05 U1.45
PL5
  Top 0.254: U2.40 36.56,16.02 40.39,12.19 73.15,12.19 81.28,20.32 U1.44
PL6
  Top 0.254: U2.41 37.06,16.28 38.1,15.24 38.23,15.11 40.64,12.7 72.39,12.7 81.28,21.59 83.82,21.59 U1.43
PL7
  Top 0.254: U2.42 37.56,16.54 40.89,13.21 71.63,13.21 81.28,22.86 U1.42
RAW  (via drill 0.51)
  Top 0.61: v3.81,17.78 8.89,17.78 10.65,16.02 J2.PWR 10.67,13.95 10.67,3.75 S2.3
  Bottom 0.61: v3.81,17.78 JP6.2
RESET  (via drill 0.51)
  Top 0.254: U1.RESET 21.59,5.08 22.48,5.97 22.48,10.67 25.16,13.35 C4.2 R3.1 27.94,13.72 31.56,17.34 U2.30 31.56,22.67 33.02,24.13 v41.4,24.13 | S1.3 62.87,26.29 62.48,26.67 53.34,26.67 52.2,25.53 J1.5 51.69,24.89 v49.15,24.89
  Bottom 0.254: v41.4,24.13 48.39,24.13 v49.15,24.89
RX0  (via drill 0.51)
  Top 0.254: U2.2 25.64,32.17 v25.17,32.64 26.75,34.21 26.75,41.43 30.84,45.52 39.93,45.52 42.16,47.75 49.02,47.75 U1.0 | JP1.3 12.7,29.21 12.7,29.49 v13.69,30.48
  Bottom 0.254: v13.69,30.48 24.31,30.48 25.17,31.34 v25.17,32.64
RX1  (via drill 0.51)
  Top 0.254: U2.45 39.06,17.33 41.66,14.73 69.34,14.73 v69.85,15.24
  Bottom 0.254: v69.85,15.24 U1.19
RX2  (via drill 0.51)
  Top 0.254: U2.12 25.66,27.17 v24.26,28.57
  Bottom 0.254: U1.17 62.87,52.7 56.01,52.7 54.74,51.44 54.74,48.39 50.93,44.58 36.32,44.58 35.18,45.72 31.24,45.72 27.3,41.78 27.3,40.26 29.34,38.23 29.34,33.66 v24.26,28.57
RX3  (via drill 0.51)
  Top 0.254: U2.63 45.72,26.67 v48.26,29.21
  Bottom 0.254: v48.26,29.21 48.26,32.89 53.21,37.85 54.99,37.85 59.69,42.55 U1.15
SCL  (via drill 0.51)
  Top 0.254: U2.43 38.06,16.8 41.15,13.72 70.87,13.72 v72.39,15.24 | R5.1 75.42,36.21 v75.56,36.07
  Bottom 0.254: 74.93,36.21 U1.21 | v72.39,15.24 72.39,30.86 71.88,31.37 71.88,33.16 74.93,36.21 | 74.93,36.21 75.42,36.21 v75.56,36.07
SDA  (via drill 0.51)
  Top 0.254: U2.44 38.56,17.07 41.4,14.22 70.1,14.22 v71.12,15.24 | R4.1 71.39,36.21 v71.12,35.94
  Bottom 0.254: U1.20 72.39,49.53 71.12,48.26 v71.12,35.94 v71.12,15.24
TX0  (via drill 0.51)
  Top 0.254: 24.13,31.67 23.47,31.67 23.04,32.11 23.04,32.87 26.14,35.97 26.14,41.68 30.56,46.1 39.75,46.1 41.91,48.26 46.99,48.26 U1.1 | 24.13,31.67 U2.3 | v23.95,31.67 24.13,31.67 | 12.7,31.85 12.7,31.75 JP1.2 13.77,32.9 v13.77,33.02
  Bottom 0.254: v23.95,31.67 22.68,32.94 13.84,32.94 v13.77,33.02
TX1  (via drill 0.51)
  Top 0.254: U2.46 39.56,17.59 41.91,15.24 68.07,15.24 v68.45,15.62
  Bottom 0.254: v68.45,15.62 68.58,49.53 U1.18
TX2  (via drill 0.51)
  Top 0.254: U2.13 23.65,26.67 v22.45,27.86
  Bottom 0.254: U1.16 60.96,52.07 56.39,52.07 55.5,51.18 55.5,48.39 51.18,44.07 36.07,44.07 34.92,45.21 31.62,45.21 27.94,41.53 27.94,40.64 29.97,38.61 29.97,29.59 27.05,26.67 23.65,26.67 v22.45,27.86
TX3  (via drill 0.51)
  Top 0.254: U2.64 44.95,27.17 v46.99,29.21
  Bottom 0.254: v46.99,29.21 46.99,32.64 52.83,38.48 53.72,38.48 57.15,41.91 U1.14
VCC  (via drill 0.51)
  Top 0.254: 29.54,28.17 30.61,28.17 33.11,25.67 39.5,25.67 | 29.54,28.17 29.54,27.36 v29.39,27.2 | J1.2 54.61,30.48 53.34,31.75 51.18,31.75 50.55,31.11 50.55,26.42 50.15,26.02 C7.1 47.83,26.02 47.48,25.67 U2.61 39.5,25.67 | U2.31 32.06,16.82 30.48,15.24 C6.1 29.73,13.35 28.43,12.05 R3.2 27.94,11.43 25.4,8.89 C1.1 24.78,6.87 24.13,6.22 U1.3.3V U1.5V@0 | 64.14,35.58 64.14,36.2 64.39,36.45 69.09,36.45 70.63,34.91 R4.2 R5.2 75.45,34.91 v75.69,34.67 | U2.100 29.56,28.19 29.54,28.17 | 29.54,28.17 U2.10 | 16.51,22.23 16.52,22.24 C8.1 19.67,22.24 21.62,20.29 U3.5 23,18.73 v23.04,18.69 | 64.14,35.58 60.47,35.58 v59.18,34.29 | 64.14,35.58 R6.2 | 16.51,22.23 16.51,17.91 C3.A | 13.72,26.67 JP1.4 | U2.80 39.56,25.73 39.5,25.67 | 16.51,22.23 16.51,23.88 13.72,26.67 | 13.72,26.67 13.72,27.18 v14.61,28.07
  Bottom 0.254: v23.04,18.69 23.04,16.33 26.67,12.7 U1.5V@0 | U1.5V@2 U1.5V@1 79.38,47.62 79.38,38.35 v75.69,34.67 | v29.39,27.2 28.09,25.91 16.76,25.91 v14.61,28.07 | J1.2 55.37,30.48 v59.18,34.29
VIN
  Top 0.61: U1.VIN 32.51,0.76 20.57,0.76 19.05,2.29 19.05,4.07 21.59,6.61 21.59,12.7 20.19,14.1 C2.A 19.02,14.13 | 19.02,14.13 U3.3 20.07,16.84 20.32,17.09 20.32,18.34 19.93,18.73 U3.1 | F1.2 16.63,15.37 17.87,14.13 19.02,14.13

### Text on the board
Bottom: 1-10-12
tPlace: + | - | Mega Pro | GRN | DTR | Power | TX0 | RX0 | VCC | GND | Reset | ISP | GND | BLK | + | 3.3V@8MHz | 5V@16MHz | - | 4-12V | EXT | BATT